# EAGLE design emonDC Buck Module v0.1 (EAGLE 8.3.2)
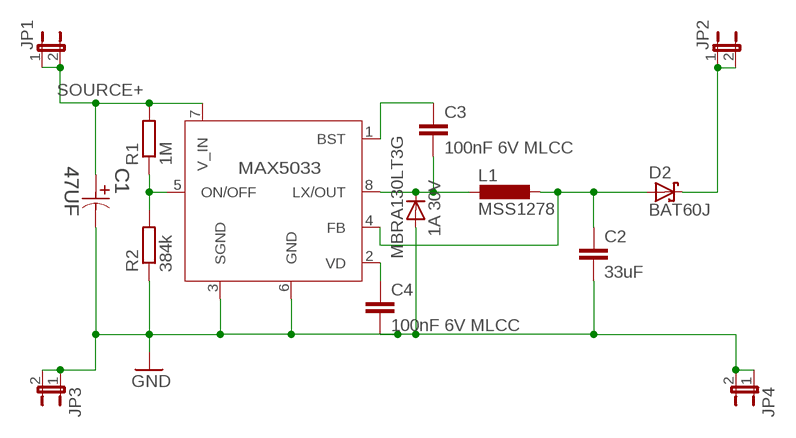
[diagram p0: schematic, sheet 1]

## Parts
C1  47UF  EEV-FK2A470Q-CASE-H13  [CAPAE1350X1400N]
C2  33uF  C-EUC1210  [C1210]
C3  100nF 6V MLCC  C-EUC0603  [C0603]
C4  100nF 6V MLCC  C-EUC0603  [C0603]
D1  MBRA130LT3G  [DO-214]
D2  BAT60J  [SOD323_ST]
JP1  JP1E  [JP1]
JP2  JP1E  [JP1]
JP3  JP1E  [JP1]
JP4  JP1E  [JP1]
L1  MSS1278  [MSS1278]
MAX5033  MAX5033BUSA+  [21-0111D_SBE-14]
R1  1M  R-EU_R0603  [R0603]
R2  384k  R-EU_R0603  [R0603]

## Nets
+5V: D2.C JP2.1 JP2.2
BST: C3.1 MAX5033.1(BST)
FB: C2.1 D2.A L1.P$1 MAX5033.4(FB)
GND [thin_power]: C1.2 C2.2 C4.2 D1.P$2(A) JP3.1 JP3.2 JP4.1 JP4.2 MAX5033.3(SGND) MAX5033.6(GND) R2.1
ONOFF: MAX5033.5(ON/OFF) R1.1 R2.2
OUT: C3.2 D1.P$1(C) L1.P$2 MAX5033.8(LX/OUT)
SOURCE+ [power]: C1.1 JP1.1 JP1.2 MAX5033.7(V_IN) R1.2
VD: C4.1 MAX5033.2(VD)

## Library data of the parts
C1 = Panasonic-EEE-EEV-EEF-ECQ:EEV-: Aluminum Electrolytic Capacitors,Surface Mount Type; MPN: EEVFK2A470Q; OC_FARNELL: 9696148; OC_NEWARK: 96K9488; SUPPLIER: PANASONIC; TOLERANCE: ±20 %; VOLTAGERATING: 100V
C2 = rcl:C-EU: CAPACITOR, European symbol; MPN: TCQB336M006R0070
C3 C4 = rcl:C-EU: CAPACITOR, European symbol
D1 = CASE 403D Diode:MBRA130LT3G: Fast switching diode; MF: ON SEMICONDUCTOR; MPN: MBRA130LT3G; OC_FARNELL: 9555978
D2 = diode:BAT60J: Schottky barrier diode Source: www.st.com, BAT60J.pdf
JP1-JP4 = jumper:JP1E: JUMPER
L1 = MSS1278:MSS1278; MPN: MSS1278-224KLD
MAX5033 = MAX5033:MAX5033BUSA+: SWITCHING REGULATOR 5.0V; MANUFACTURER_PART_NUMBER: MAX5033BUSA+; VENDOR: MAXIM
R1 R2 = rcl:R-EU_: RESISTOR, European symbol

## Net classes
1 power: width 1.016 mm
2 thin_power: width 0.254 mm

## Board
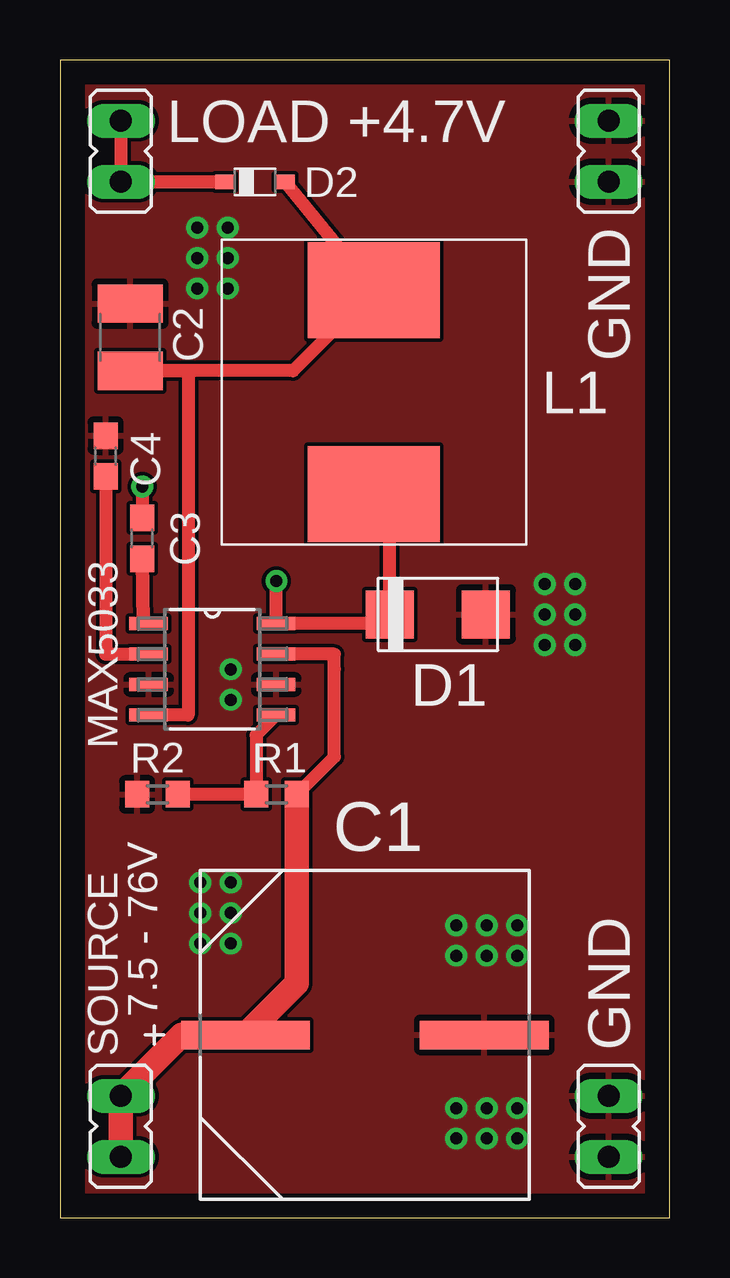
[diagram p1: board, top side]
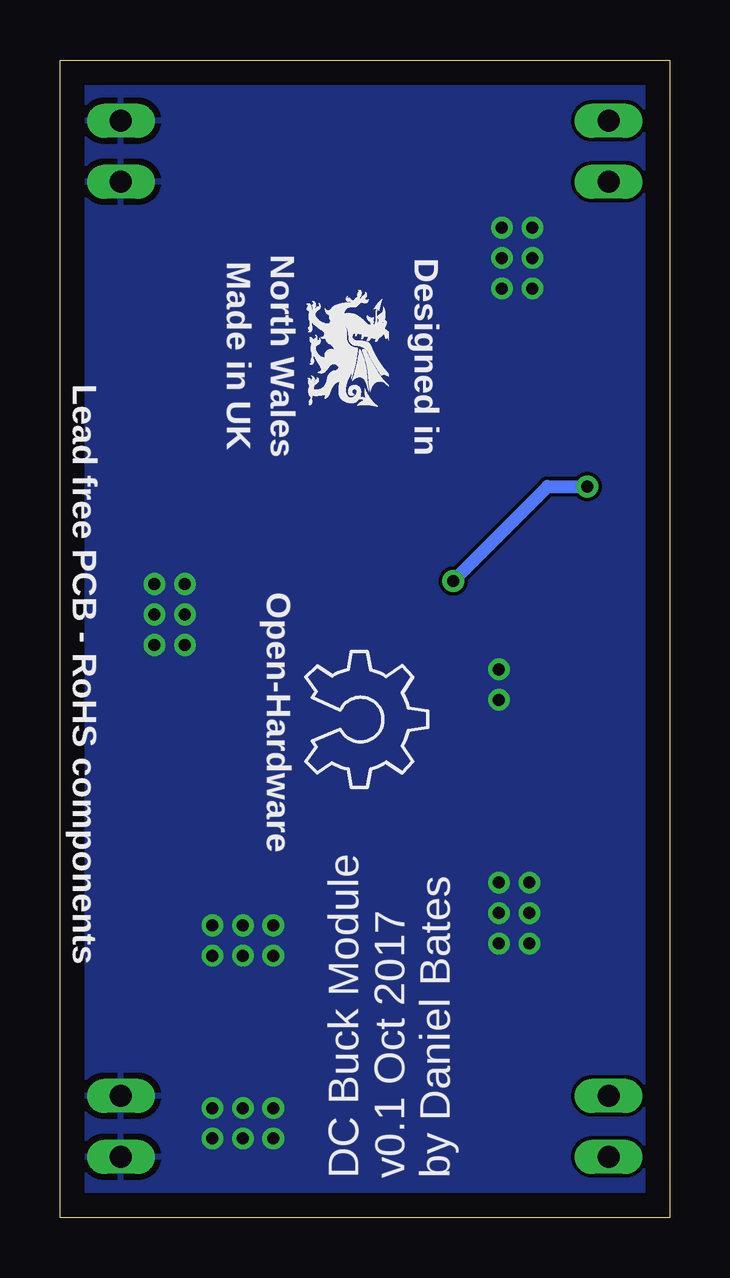
[diagram p2: board, bottom side, seen from below]

Size 25.4 x 48.26 mm. Coordinates in mm from the lower left corner, seen from the top.
Outline: 0,0 25.4,0 25.4,48.26 0,48.25 0,0
Copper layers (1*16): Top 0.035mm / dielectric 1.5mm / Bottom 0.035mm
Design rules "default": minimum track width 6mil, minimum drill 0.35mm, track to track 6mil, track to pad 6mil, pad to pad 6mil, via to via 6mil, smd to smd 6mil, copper to edge 40mil, drill to drill 6mil, minimum pad ring 10mil, minimum via ring 8mil, stop-mask expansion 4mil, vias tented up to drill 0mil, thermal gap 10mil

### Footprints (pad centres in the part's own frame; a part is rotated, then mirrored left to right if it is on the bottom)
CAPAE1350X1400N = smd 5.359 x 1.194: 1 -4.978,0; 2 4.978,0
C1210 = smd 1.6 x 2.7: 1 -1.4,0; 2 1.4,0
C0603 = smd 1.1 x 1: 1 -0.85,0; 2 0.85,0
DO-214 = smd 2 x 2: P$1 -2,0; P$2 2,0
SOD323_ST = smd 0.8 x 0.6: A 1.25,0; C -1.25,0
JP1 = drill 0.914 long: 1 0,-1.27; 2 0,1.27
MSS1278 = smd 5.5 x 4: P$1 0,4.25; P$2 0,-4.25
21-0111D_SBE-14 = smd 1.6 x 0.533: 1 -2.654,1.905; 2 -2.654,0.635; 3 -2.654,-0.635; 4 -2.654,-1.905; 5 2.654,-1.905; 6 2.654,-0.635; 7 2.654,0.635; 8 2.654,1.905
R0603 = smd 1 x 1.1: 1 -0.85,0; 2 0.85,0

### Placement (x,y rotation side)
C1  12.7,7.62 0 top
C2  2.92,36.7 90 top
C3  3.43,28.32 90 top
C4  1.91,31.75 90 top
D1  15.75,25.15 0 top
D2  8.13,43.18 0 top
JP1  2.54,3.81 0 top
JP2  2.54,44.45 0 top
JP3  22.86,3.81 0 top
JP4  22.86,44.45 0 top
L1  13.08,34.42 0 top
LOGO2  OSHW_LOGO_6MILX0200-NT  [OSHW_6X200_NOTEXT]  15.16,23.61 270 bottom
MAX5033  6.35,22.86 0 top
R1  9.02,17.65 0 top
R2  4.06,17.65 0 top

### Tracks (layer width: path | path; a pad name or v marks a point on that pad's centre or on a via)
+5V
  Top 0.533: D2.C JP2.1 JP2.2
BST
  Top 0.559: C3.1 3.47,24.77 MAX5033.1
FB
  Top 0.533: D2.A L1.P$1 9.72,35.3 C2.1 | MAX5033.4 5.33,20.95 5.33,35.3
  Top 0.559: C2.1 5.33,35.3
GND  (via drill 0.5)
  other vias: 7.11,13.97 6.99,41.27 6.99,40.01 6.99,38.73 5.71,38.73 5.71,40.01 5.71,41.27 7.11,12.7 7.11,11.43 5.84,11.43 5.84,12.7 5.84,13.97 16.51,4.57 17.78,4.57 19.05,4.57 19.05,3.3 17.78,3.3 16.51,3.3 16.51,12.19 17.78,12.19 19.05,12.19 19.05,10.92 17.78,10.92 16.51,10.92 21.46,26.42 21.46,25.15 21.46,23.88 20.19,23.88 20.19,25.15 20.19,26.42 7.11,21.59 7.11,22.86
  pour Top: 25.4,48.26 0,48.26 0,0 25.4,0
  pour Bottom: 0,0 25.4,0 25.4,48.26 0,48.26
ONOFF
  Top 0.533: R2.2 R1.1 8.17,20.12 MAX5033.5
OUT  (via drill 0.5)
  Top 0.533: 13.37,24.77 MAX5033.8 9,26.53 | D1.P$1 13.75,29.5 | v3.43,30.48 C3.2
  Top 0.559: 13.37,24.77 arc90 D1.P$1 | 13.75,29.5 arc90 L1.P$2 | 9,26.53 v9.02,26.54
  Bottom 0.533: v9.02,26.54 5.08,30.48 v3.43,30.48
SOURCE+
  Top 0.533: R1.2 11.43,19.22 11.43,22.86 11.43,23.5 MAX5033.7
  Top 1.016: R1.2 9.87,9.77 C1.1 5.08,7.62 JP1.2 JP1.1
VD
  Top 0.533: C4.1 1.91,23.5 MAX5033.2

### Text on the board
bPlace: Designed in | North Wales | Made in UK | Lead free PCB - RoHS components | Open-Hardware
tNames: LOAD +4.7V | GND | L1 | D1 | 7.5 - 76V | SOURCE | GND
bNames: DC Buck Module / v0.1 Oct 2017 / by Daniel Bates